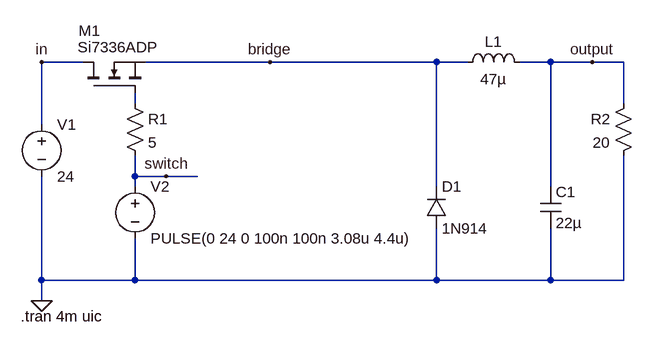
[diagram p0: schematic async_buck.asc]
async_buck.asc, the LTspice schematic file:
Version 4
SHEET 1 1044 680
WIRE 96 32 32 32
WIRE 384 32 192 32
WIRE 640 32 384 32
WIRE 688 32 640 32
WIRE 816 32 768 32
WIRE 880 32 816 32
WIRE 928 32 880 32
WIRE 176 96 176 80
WIRE 928 96 928 32
WIRE 32 128 32 32
WIRE 176 208 176 176
WIRE 224 208 176 208
WIRE 272 208 224 208
WIRE 176 224 176 208
WIRE 640 224 640 32
WIRE 816 224 816 32
WIRE 32 368 32 208
WIRE 176 368 176 304
WIRE 176 368 32 368
WIRE 640 368 640 288
WIRE 640 368 176 368
WIRE 816 368 816 288
WIRE 816 368 640 368
WIRE 928 368 928 176
WIRE 928 368 816 368
WIRE 32 400 32 368
FLAG 32 400 0
FLAG 880 32 output
FLAG 384 32 bridge
FLAG 224 208 switch
FLAG 32 32 in
SYMBOL voltage 32 112 R0
WINDOW 123 0 0 Left 0
WINDOW 39 0 0 Left 0
SYMATTR InstName V1
SYMATTR Value 24
SYMBOL nmos 96 80 R270
WINDOW 0 96 -7 VRight 2
WINDOW 3 71 115 VLeft 2
SYMATTR InstName M1
SYMATTR Value Si7336ADP
SYMBOL res 160 80 R0
SYMATTR InstName R1
SYMATTR Value 5
SYMBOL voltage 176 208 R0
WINDOW 123 0 0 Left 0
WINDOW 39 0 0 Left 0
SYMATTR InstName V2
SYMATTR Value PULSE(0 24 0 100n 100n 3.08u 4.4u)
SYMBOL diode 624 288 M180
WINDOW 0 24 64 Left 2
WINDOW 3 24 0 Left 2
SYMATTR InstName D1
SYMATTR Value 1N914
SYMBOL ind 672 48 R270
WINDOW 0 32 56 VTop 2
WINDOW 3 5 56 VBottom 2
SYMATTR InstName L1
SYMATTR Value 47µ
SYMBOL cap 800 224 R0
SYMATTR InstName C1
SYMATTR Value 22µ
SYMBOL res 944 80 M0
SYMATTR InstName R2
SYMATTR Value 20
TEXT 0 424 Left 2 !.tran 4m uic

The netlist it stands for:
* async_buck.asc
V1 in 0 24
M1 in N001 bridge bridge Si7336ADP
R1 N001 switch 5
V2 switch 0 PULSE(0 24 0 100n 100n 3.08u 4.4u)
D1 0 bridge 1N914
L1 bridge output 47µ
C1 output 0 22µ
R2 output 0 20
.model D D
.lib standard.dio
.model NMOS NMOS
.model PMOS PMOS
.lib standard.mos
.tran 4m uic
.backanno
.end